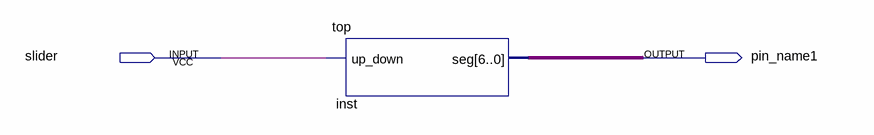
[diagram p0: schematic sheet]
// Quartus schematic ContadorUpDown.bdf as structural Verilog: 1 symbols, 2 pins
module ContadorUpDown (
  input  slider,
  output pin_name1
);

  wire [6:0] inst_seg;

  top inst (.up_down(slider), .seg(inst_seg));
endmodule
